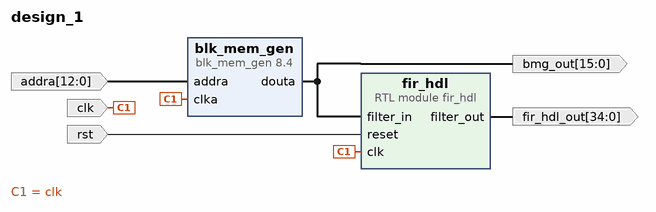
[diagram p0: block diagram of the top level]
# Vivado block design design_1, xczu28dr-ffvg1517-1-e, Vivado 2022.1
create_bd_design design_1

create_bd_port -dir I -from 12 -to 0 addra
create_bd_port -dir I -type clk clk
set_property -dict {CONFIG.FREQ_HZ 100000000} [get_bd_ports clk]
create_bd_port -dir O -from 15 -to 0 bmg_out
create_bd_port -dir I -type rst rst
create_bd_port -dir O -from 34 -to 0 fir_hdl_out

create_bd_cell -type ip -vlnv xilinx.com:ip:blk_mem_gen:8.4 blk_mem_gen
set_property -dict [list \
  CONFIG.Coe_File ../../../../../../../../8192_data_with_interference.coe \
  CONFIG.Enable_32bit_Address false \
  CONFIG.Enable_A Always_Enabled \
  CONFIG.Load_Init_File true \
  CONFIG.Memory_Type Single_Port_ROM \
  CONFIG.Port_A_Write_Rate 0 \
  CONFIG.Register_PortA_Output_of_Memory_Primitives false \
  CONFIG.Use_RSTA_Pin false \
  CONFIG.Write_Width_A 16 \
  CONFIG.use_bram_block Stand_Alone \
] [get_bd_cells blk_mem_gen]
create_bd_cell -type module -reference fir_hdl fir_hdl

# ---- connections ----

connect_bd_net [get_bd_ports addra] [get_bd_pins blk_mem_gen/addra]
connect_bd_net -net blk_mem_gen_0_douta [get_bd_pins blk_mem_gen/douta] [get_bd_ports bmg_out] [get_bd_pins fir_hdl/filter_in]
connect_bd_net [get_bd_ports clk] [get_bd_pins blk_mem_gen/clka] [get_bd_pins fir_hdl/clk]
connect_bd_net [get_bd_pins fir_hdl/filter_out] [get_bd_ports fir_hdl_out]
connect_bd_net [get_bd_ports rst] [get_bd_pins fir_hdl/reset]

validate_bd_design
save_bd_design
